# Altium schematic sheet STM32F103RCT6_Mini_System.SchDoc
size A1; SheetNumber: 1; SheetTotal: 1
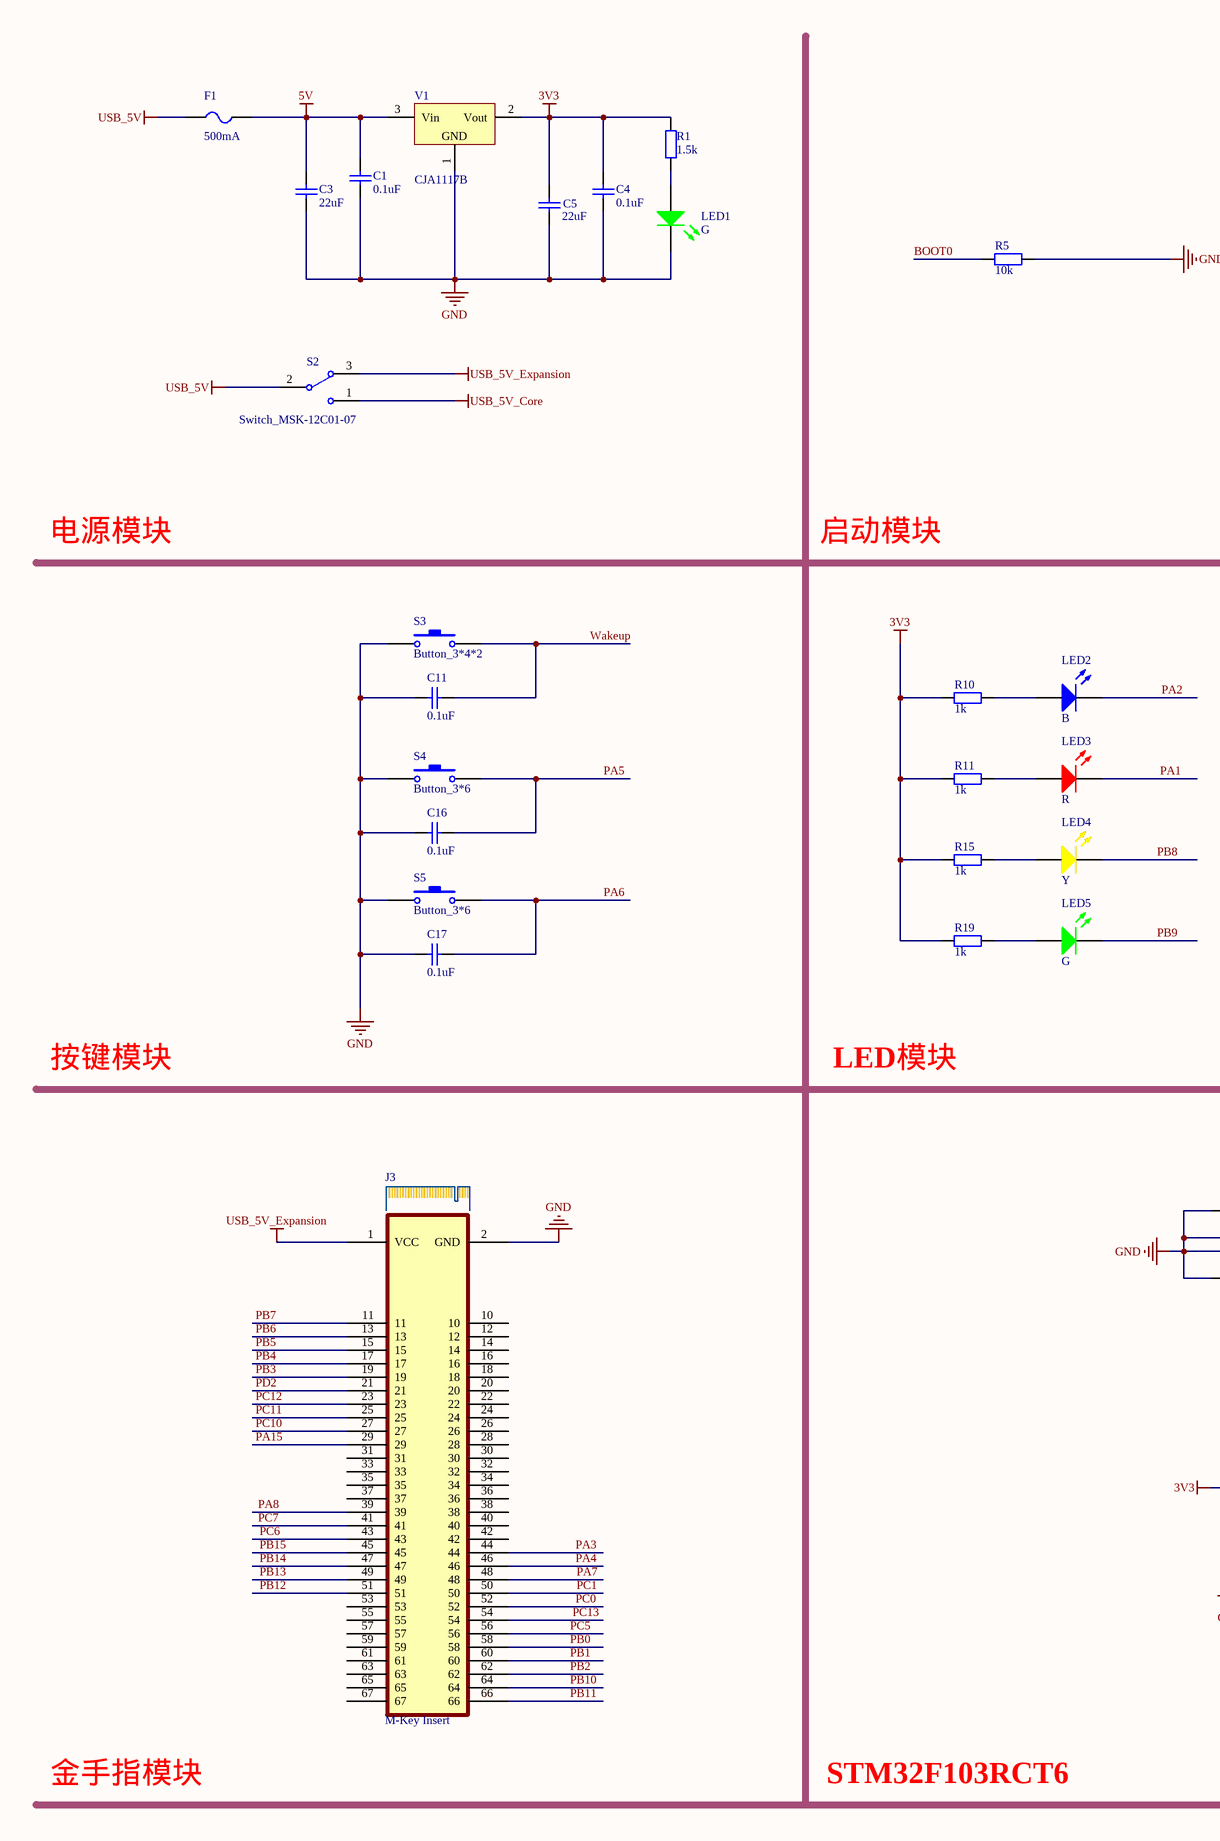
[diagram p0: STM32F103RCT6_Mini_System.SchDoc, left]
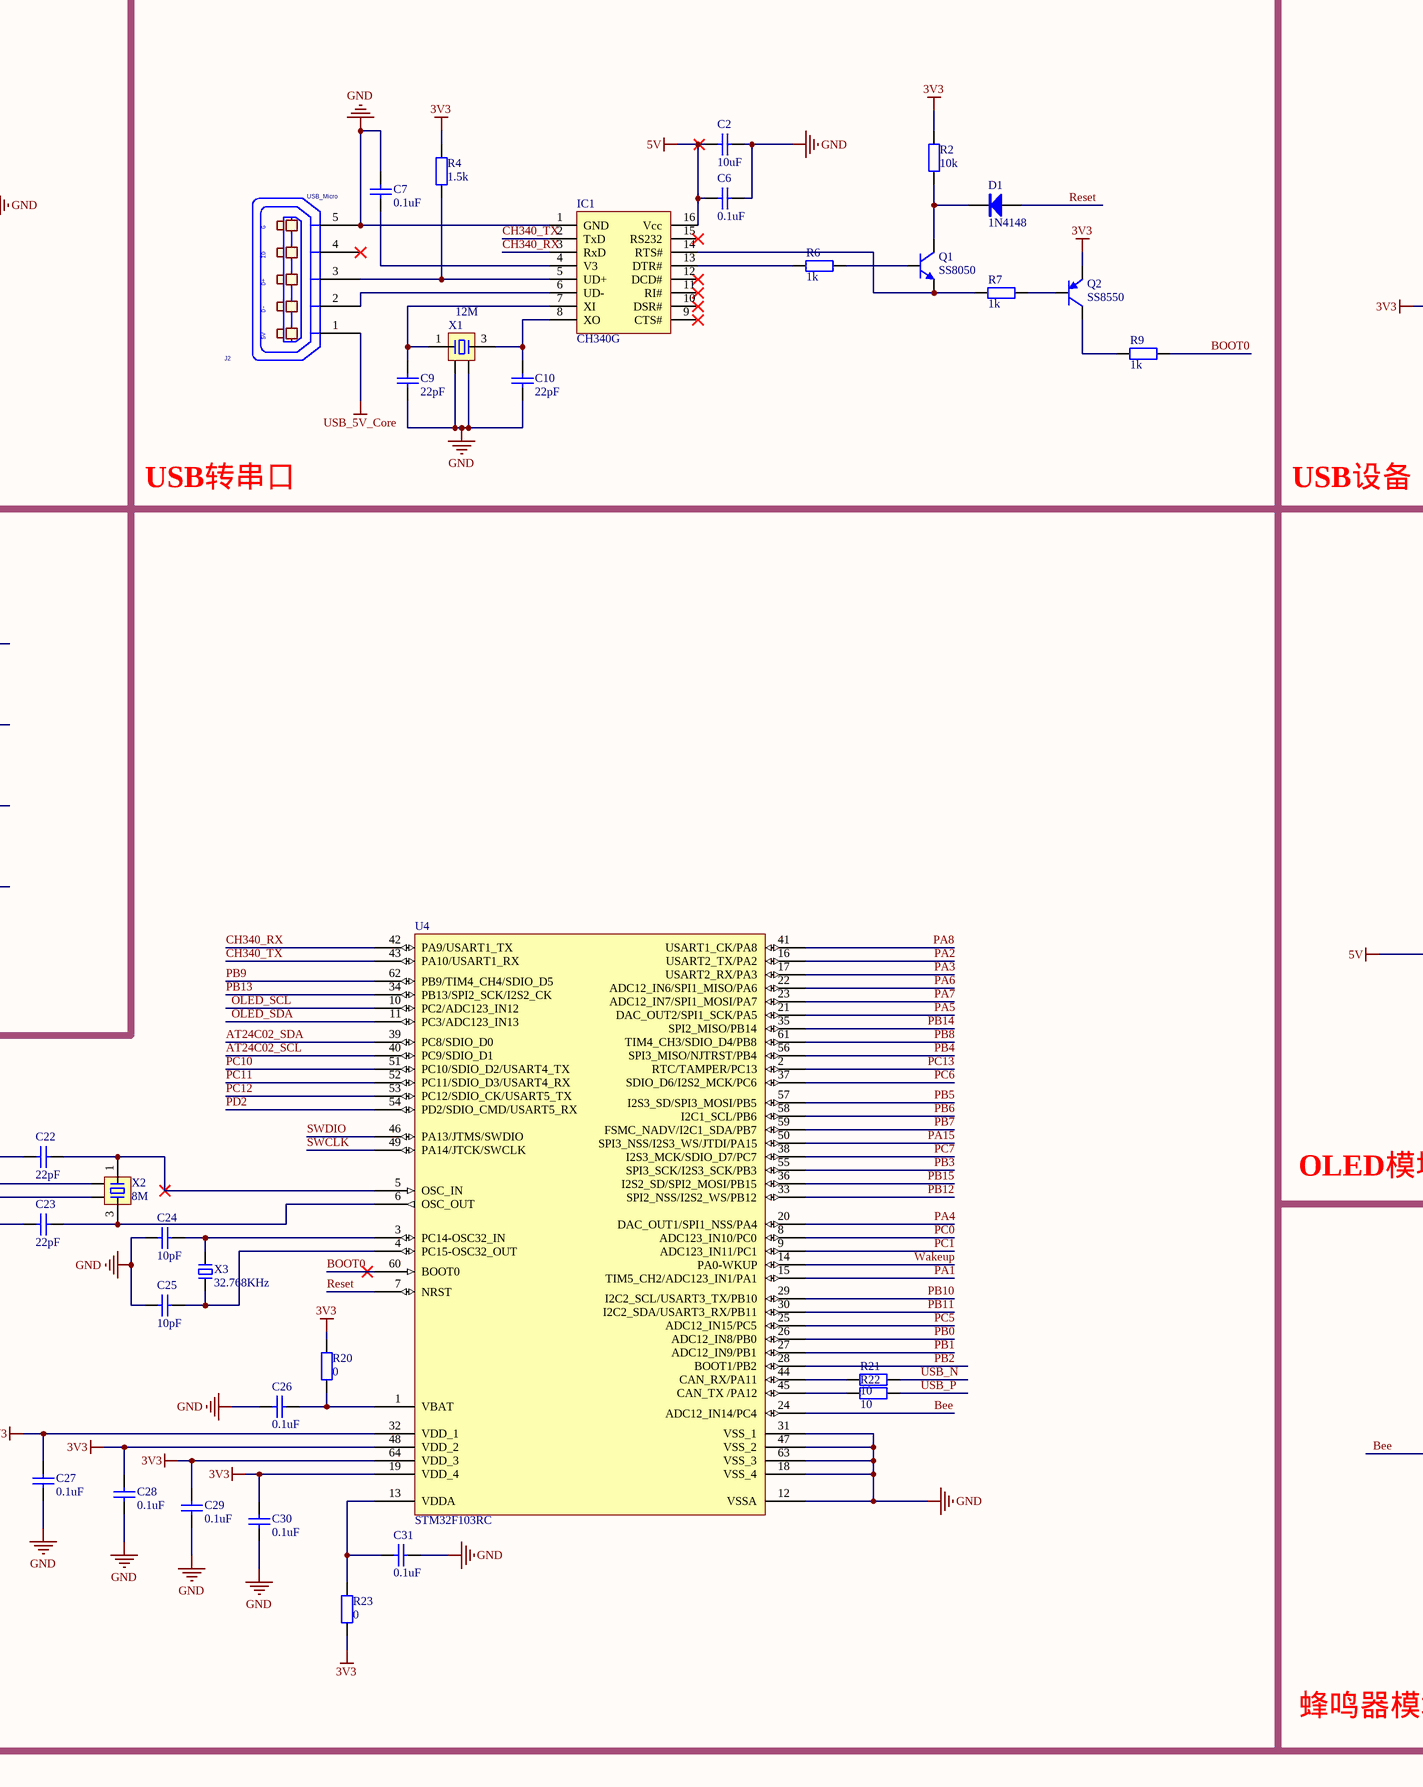
[diagram p1: STM32F103RCT6_Mini_System.SchDoc, middle]
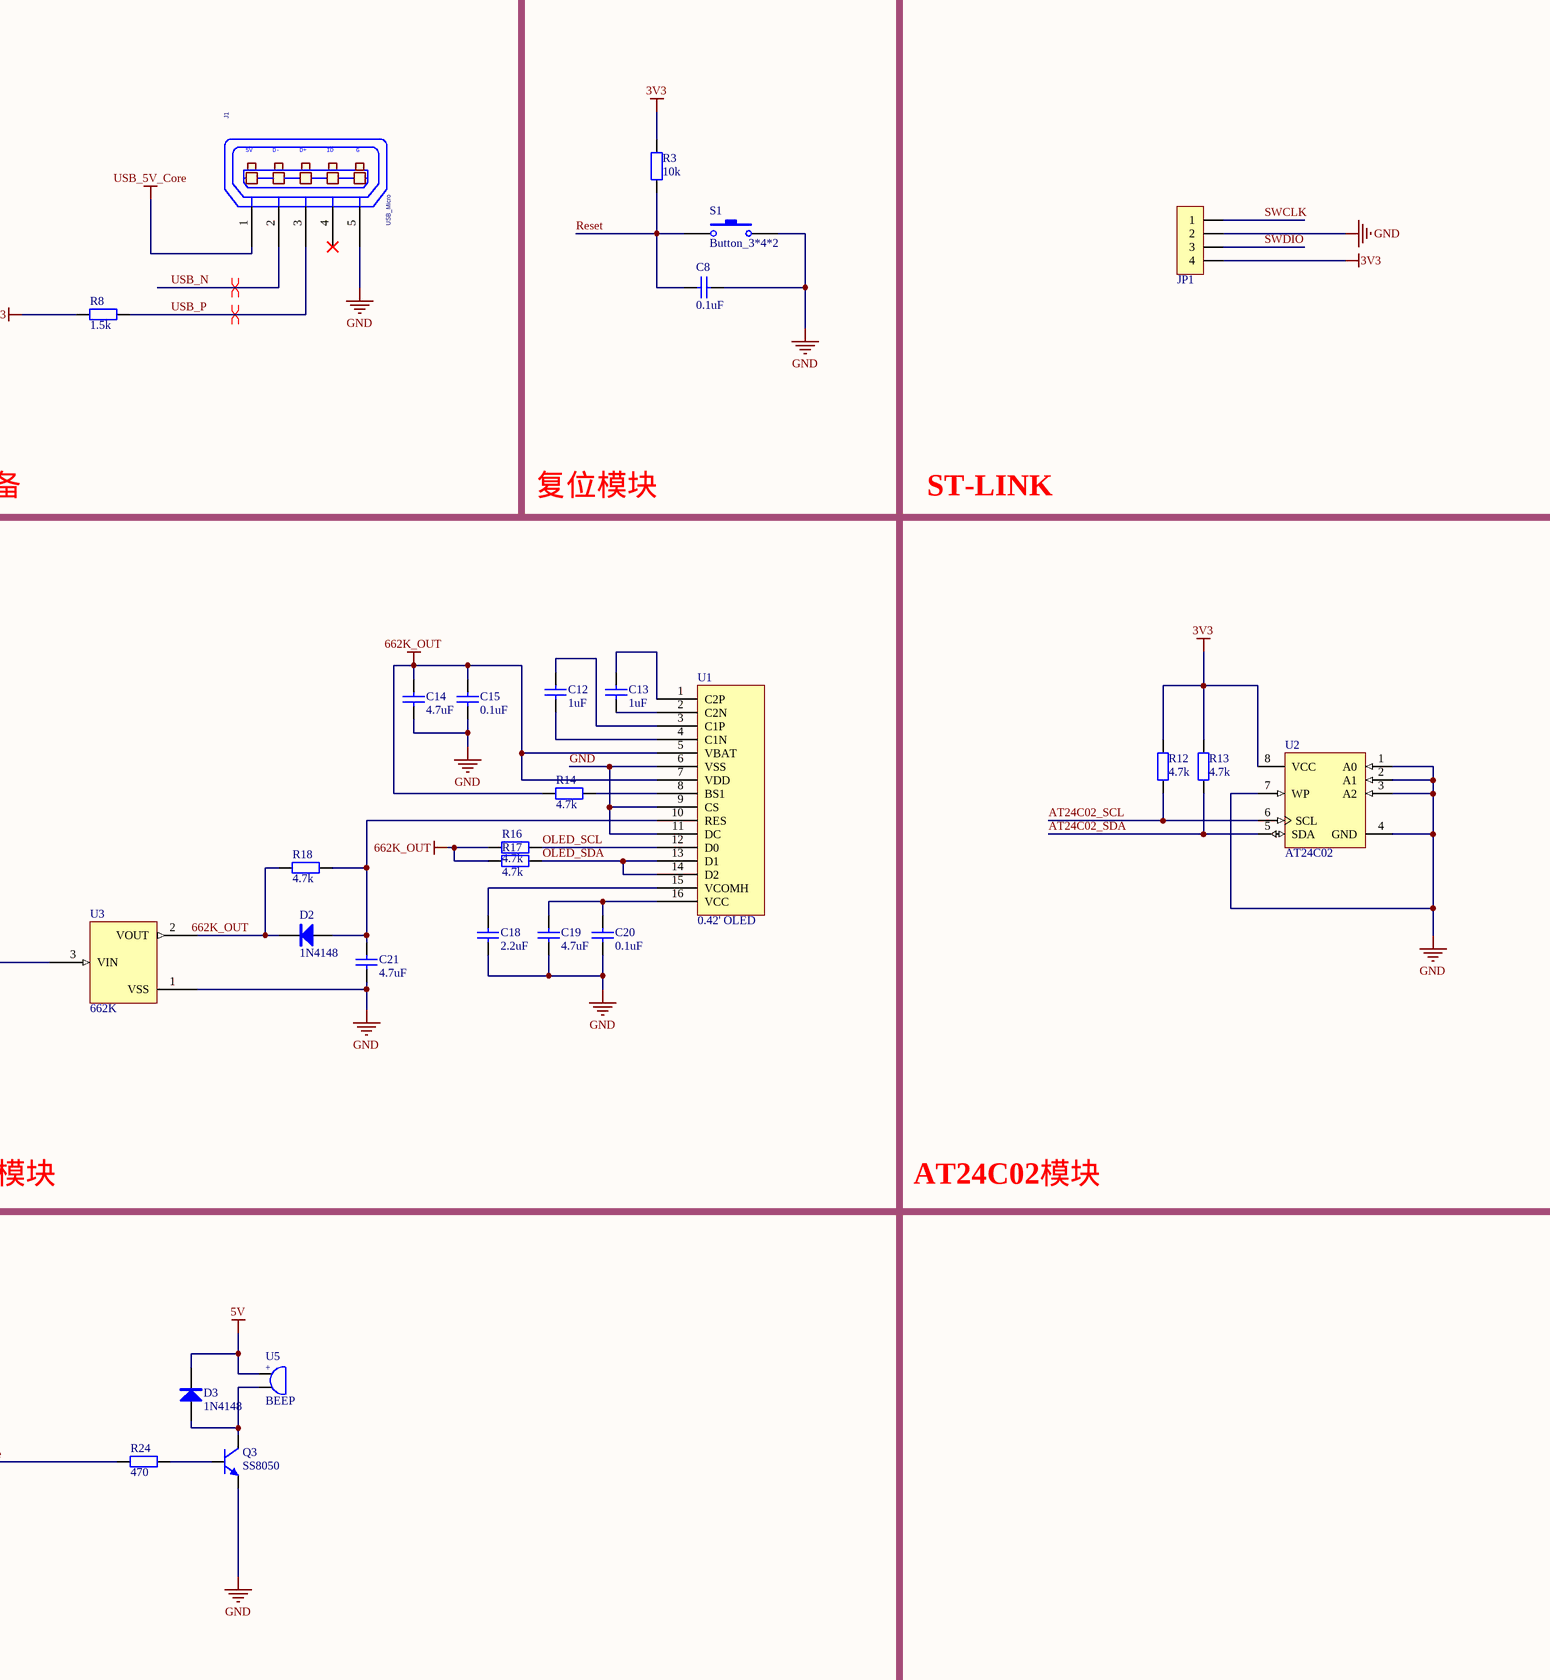
[diagram p2: STM32F103RCT6_Mini_System.SchDoc, right]

## Parts
C1  0.1uF  [0805_C]
C2  10uF  [0805_C]
C3  22uF  [0805_C]
C4  0.1uF  [0805_C]
C5  22uF  [0805_C]
C6  0.1uF  [0805_C]
C7  0.1uF  [0805_C]
C8  0.1uF  [0805_C]
C9  22pF  [0805_C]
C10  22pF  [0805_C]
C11  0.1uF  [0805_C]
C12  1uF  [0805_C]
C13  1uF  [0805_C]
C14  4.7uF  [0805_C]
C15  0.1uF  [0805_C]
C16  0.1uF  [0805_C]
C17  0.1uF  [0805_C]
C18  2.2uF  [0805_C]
C19  4.7uF  [0805_C]
C20  0.1uF  [0805_C]
C21  4.7uF  [0805_C]
C22  22pF  [0805_C]
C23  22pF  [0805_C]
C24  10pF  [0805_C]
C25  10pF  [0805_C]
C26  0.1uF  [0805_C]
C27  0.1uF  [0805_C]
C28  0.1uF  [0805_C]
C29  0.1uF  [0805_C]
C30  0.1uF  [0805_C]
C31  0.1uF  [0805_C]
D1  1N4148  [SOD-323]
D2  1N4148  [SOD-323]
D3  1N4148  [SOD-323]
F1  500mA  [FU 1210]
IC1  CH340G  [SOP16_N]
J1  USB_Micro  [USB-MICRO]
J2  USB_Micro  [USB-MICRO]
J3  M-Key Insert  [M-Key Insert big GND&VCC]
JP1  HDR-1X4  [XH2.54-WS-4P]  (value not drawn)
LED1  G  [LED 0805G]
LED2  B  [LED 0805B]
LED3  R  [LED 0805R]
LED4  Y  [LED 0805Y]
LED5  G  [LED 0805G]
Q1  SS8050  [SOT23-3N]
Q2  SS8550  [SOT23-3N]
Q3  SS8050  [SOT23-3N]
R1  1.5k  [0805_R]
R2  10k  [0805_R]
R3  10k  [0805_R]
R4  1.5k  [0805_R]
R5  10k  [0805_R]
R6  1k  [0805_R]
R7  1k  [0805_R]
R8  1.5k  [0805_R]
R9  1k  [0805_R]
R10  1k  [0805_R]
R11  1k  [0805_R]
R12  4.7k  [0805_R]
R13  4.7k  [0805_R]
R14  4.7k  [0805_R]
R15  1k  [0805_R]
R16  4.7k  [0805_R]
R17  4.7k  [0805_R]
R18  4.7k  [0805_R]
R19  1k  [0805_R]
R20  0  [0805_R]
R21  10  [0805_R]
R22  10  [0805_R]
R23  0  [0805_R]
R24  470  [0805_R]
S1  Button_3*4*2  [TSW SMD-3*4*2]
S2  Switch_MSK-12C01-07  [MSK-12C01-07]
S3  Button_3*4*2  [TSW SMD-3*4*2]
S4  Button_3*6  [TSW SMD-3*6*4.3_V]
S5  Button_3*6  [TSW SMD-3*6*4.3_V]
U1  0.42' OLED  [OLED 0.42']
U2  AT24C02  [SOP8_N]
U3  662K  [SOT23-3N]
U4  STM32F103RC  [LQFP64 10X10_N]
U5  BEEP  [Bee_5020]
V1  CJA1117B  [SOT89_N]
X1  12M  [OSC 3225-4P]
X2  8M  [OSC 3225-4P]
X3  32.768KHz  [OSC 3215-2P]

## Nets
3V3: C4.2 C5.2 C27.2 C28.2 C29.2 C30.2 JP1.4 Q2.2(E) R1.2 R2.2 R3.1 R4.1 R8.1 R10.1 R11.1 R12.2 R13.2 R15.1 R19.1 R20.1 R23.1 U2.8(VCC) U4.19(VDD_4) U4.32(VDD_1) U4.48(VDD_2) U4.64(VDD_3) V1.2(Vout)
5V: C1.2 C2.2 C3.2 C6.2 D3.2(K) F1.2 IC1.16(Vcc) U3.3(VIN) U5.1 V1.3(Vin)
662K_OUT: C14.2 C15.2 R14.1 R16.1 R17.1 U1.5(VBAT) U1.7(VDD)
GND: C1.1 C2.1 C3.1 C4.1 C5.1 C6.1 C7.2 C8.1 C9.1 C10.1 C11.1 C14.1 C15.1 C16.1 C17.1 C18.1 C19.1 C20.1 C21.1 C22.2 C23.2 C24.2 C25.2 C26.1 C27.1 C28.1 C29.1 C30.1 C31.1 IC1.1(GND) J1.5(P5) J2.5(P5) J3.2(GND) JP1.2 LED1.2(K) Q3.2(E) R5.2 S1.2 S3.1 S4.1 S5.1 U1.6(VSS) U1.9(CS) U1.11(DC) U2.1(A0) U2.2(A1) U2.3(A2) U2.4(GND) U2.7(WP) U3.1(VSS) U4.12(VSSA) U4.18(VSS_4) U4.31(VSS_1) U4.47(VSS_2) U4.63(VSS_3) V1.1(GND) X1.2 X1.4 X2.2 X2.4
USB_5V: F1.1 S2.2
USB_5V_Core: J1.1(P1) J2.1(P1) S2.1
USB_5V_Expansion: J3.1(VCC) S2.3
AT24C02_SCL: R12.1 U2.6(SCL) U4.40(PC9/SDIO_D1)
AT24C02_SDA: R13.1 U2.5(SDA) U4.39(PC8/SDIO_D0)
Bee: R24.1 U4.24(ADC12_IN14/PC4)
BOOT0: R5.1 R9.1 U4.60(BOOT0)
CH340_RX: IC1.3(RxD) U4.42(PA9/USART1_TX)
CH340_TX: IC1.2(TxD) U4.43(PA10/USART1_RX)
OLED_SCL: R16.2 U1.12(D0) U4.10(PC2/ADC123_IN12)
OLED_SDA: R17.2 U1.13(D1) U1.14(D2) U4.11(PC3/ADC123_IN13)
PA1: LED3.2(K) U4.15(TIM5_CH2/ADC123_IN1/PA1)
PA2: LED2.2(K) U4.16(USART2_TX/PA2)
PA3: J3.44 U4.17(USART2_RX/PA3)
PA4: J3.46 U4.20(DAC_OUT1/SPI1_NSS/PA4)
PA5: C16.2 S4.2 U4.21(DAC_OUT2/SPI1_SCK/PA5)
PA6: C17.2 S5.2 U4.22(ADC12_IN6/SPI1_MISO/PA6)
PA7: J3.48 U4.23(ADC12_IN7/SPI1_MOSI/PA7)
PA8: J3.39 U4.41(USART1_CK/PA8)
PA15: J3.29 U4.50(SPI3_NSS/I2S3_WS/JTDI/PA15)
PB0: J3.58 U4.26(ADC12_IN8/PB0)
PB1: J3.60 U4.27(ADC12_IN9/PB1)
PB2: J3.62 U4.28(BOOT1/PB2)
PB3: J3.19 U4.55(SPI3_SCK/I2S3_SCK/PB3)
PB4: J3.17 U4.56(SPI3_MISO/NJTRST/PB4)
PB5: J3.15 U4.57(I2S3_SD/SPI3_MOSI/PB5)
PB6: J3.13 U4.58(I2C1_SCL/PB6)
PB7: J3.11 U4.59(FSMC_NADV/I2C1_SDA/PB7)
PB8: LED4.2(K) U4.61(TIM4_CH3/SDIO_D4/PB8)
PB9: LED5.2(K) U4.62(PB9/TIM4_CH4/SDIO_D5)
PB10: J3.64 U4.29(I2C2_SCL/USART3_TX/PB10)
PB11: J3.66 U4.30(I2C2_SDA/USART3_RX/PB11)
PB12: J3.51 U4.33(SPI2_NSS/I2S2_WS/PB12)
PB13: J3.49 U4.34(PB13/SPI2_SCK/I2S2_CK)
PB14: J3.47 U4.35(SPI2_MISO/PB14)
PB15: J3.45 U4.36(I2S2_SD/SPI2_MOSI/PB15)
PC0: J3.52 U4.8(ADC123_IN10/PC0)
PC1: J3.50 U4.9(ADC123_IN11/PC1)
PC5: J3.56 U4.25(ADC12_IN15/PC5)
PC6: J3.43 U4.37(SDIO_D6/I2S2_MCK/PC6)
PC7: J3.41 U4.38(I2S3_MCK/SDIO_D7/PC7)
PC10: J3.27 U4.51(PC10/SDIO_D2/USART4_TX)
PC11: J3.25 U4.52(PC11/SDIO_D3/USART4_RX)
PC12: J3.23 U4.53(PC12/SDIO_CK/USART5_TX)
PC13: J3.54 U4.2(RTC/TAMPER/PC13)
PD2: J3.21 U4.54(PD2/SDIO_CMD/USART5_RX)
Reset: C8.2 D1.1(A) R3.2 S1.1 U4.7(NRST)
SWCLK: JP1.1 U4.49(PA14/JTCK/SWCLK)
SWDIO: JP1.3 U4.46(PA13/JTMS/SWDIO)
USB_N: J1.2(P2) R21.1
USB_P: J1.3(P3) R8.2 R22.1
Wakeup: C11.2 S3.2 U4.14(PA0-WKUP)
NetC7_1: C7.1 IC1.4(V3)
NetC9_2: C9.2 IC1.7(XI) X1.1
NetC10_2: C10.2 IC1.8(XO) X1.3
NetC12_1: C12.1 U1.3(C1P)
NetC12_2: C12.2 U1.4(C1N)
NetC13_1: C13.1 U1.1(C2P)
NetC13_2: C13.2 U1.2(C2N)
NetC18_2: C18.2 U1.15(VCOMH)
NetC19_2: C19.2 C20.2 U1.16(VCC)
NetC21_2: C21.2 D2.1(A) R18.2 U1.10(RES)
NetC22_1: C22.1 U4.5(OSC_IN) X2.1
NetC23_1: C23.1 U4.6(OSC_OUT) X2.3
NetC24_1: C24.1 U4.3(PC14-OSC32_IN) X3.2
NetC25_1: C25.1 U4.4(PC15-OSC32_OUT) X3.1
NetC26_2: C26.2 R20.2 U4.1(VBAT)
NetC31_2: C31.2 R23.2 U4.13(VDDA)
NetD1_2: D1.2(K) Q1.3(C) R2.1
NetD2_2: D2.2(K) R18.1 U3.2(VOUT)
NetD3_1: D3.1(A) Q3.3(C) U5.2
NetIC1_5: IC1.5(UD+) J2.3(P3) R4.2
NetIC1_6: IC1.6(UD-) J2.2(P2)
NetIC1_13: IC1.13(DTR#) R6.1
NetIC1_14: IC1.14(RTS#) Q1.2(E) R7.1
NetLED1_1: LED1.1(A) R1.1
NetLED2_1: LED2.1(A) R10.2
NetLED3_1: LED3.1(A) R11.2
NetLED4_1: LED4.1(A) R15.2
NetLED5_1: LED5.1(A) R19.2
NetQ1_1: Q1.1(B) R6.2
NetQ2_1: Q2.1(B) R7.2
NetQ2_3: Q2.3(C) R9.2
NetQ3_1: Q3.1(B) R24.2
NetR14_2: R14.2 U1.8(BS1)
NetR21_2: R21.2 U4.44(CAN_RX/PA11)
NetR22_2: R22.2 U4.45(CAN_TX_/PA12)

Not connected (* = marked no-connect by the designer): IC1 9(CTS#)* 10(DSR#)* 11(RI#)* 12(DCD#)* 15(RS232)*; J1 4(P4)*; J2 4(P4)*; J3 10 12 14 16 18 20 22 24 26 28 30 31 32 33 34 35 36 37 38 40 42 53 55 57 59 61 63 65 67

## Layout directives
differential pair: USB_N, USB_P

## Notes on the sheet
- 电源模块
- 启动模块
- USB转串口
- USB设备
- 复位模块
- ST-LINK
- 按键模块
- LED模块
- OLED模块
- AT24C02模块
- 金手指模块
- STM32F103RCT6
- 蜂鸣器模块
- Labels drawn without touching a wire or pin: 662K_OUT
- (in symbol BEEP) +
- (in symbol USB_Micro) G; ID; D+; D-; 5V

## Library data of the parts
C1-C8 C11 C16 C17 C26-C31 = Cap_SMD: 0805贴片电容; Value: 100nF; Voltage: 63V; Published: 8-Jun-2000; Revision: July-2002: Re-released for DXP Platform.; Publisher: Altium Limited; 实物样品照片: https://item.taobao.com/item.htm?spm=a230r.1.14.32.21fd24b7VWml4d&id=37914290992&ns=1&abbucket=13#detail
C9 C10 C12-C15 C18-C25 = Cap_SMD: 贴片电容; Value: 100nF; Voltage: 63V; Published: 8-Jun-2000; Revision: July-2002: Re-released for DXP Platform.; Publisher: Altium Limited; 实物样品照片: https://item.taobao.com/item.htm?spm=a230r.1.14.32.21fd24b7VWml4d&id=37914290992&ns=1&abbucket=13#detail
D1-D3 = 1N4148: 高速开关二极管; 版权归属: 源创客; BOM名称: 高速开关二极管; 学习资源: www.ooocke.com
F1 = FU: 贴片保险丝; 版权归属: 源创客; BOM名称: 贴片保险丝; 学习资源: www.ooocke.com
IC1 = CH340G: 串口转USB; 版权归属: 源创客; BOM名称: 串口转USB; 学习资源: www.ooocke.com
J1 J2 = USB_Micro: CLASS: IO; AGILE_PN: 211-80104; MFG_NAME01: ANYTRONIC CORPORATION LIMITED; MFG_PN01: 23970101#LCP-58LF; Temp_Range: -55&#8451; to 105&#8451;; CAD_APPROVED: Yes; ROHS: Yes; HEIGHT: 2.8MM
J3 = M-Key Insert  big GND&VCC: M.2 金手指
JP1 = Header 4: 4P接插件; 版权归属: 源创客; BOM名称: 4P接插件; 学习资源: www.ooocke.com
LED1 LED5 = LED_G: 绿色LED; Published: 8-Jun-2000; Revision: July-2002: Re-released for DXP Platform.; Publisher: Altium Limited
LED2 = LED_B: 蓝色LED; Published: 8-Jun-2000; Revision: July-2002: Re-released for DXP Platform.; Publisher: Altium Limited
LED3 = LED_R: 红色LED; Published: 8-Jun-2000; Revision: July-2002: Re-released for DXP Platform.; Publisher: Altium Limited
LED4 = LED_Y: 黄色LED; Published: 8-Jun-2000; Revision: July-2002: Re-released for DXP Platform.; Publisher: Altium Limited
Q1 Q3 = 8050-SMD: 高频放大-NPN型; 版权归属: 源创客; 属性: 40V 1.5A 1W 100MHZ; BOM名称: 高频放大-NPN型; 学习资源: www.ooocke.com
Q2 = 8550-SMD: 高频放大-PNP型; 版权归属: 源创客; 属性: 40V 1.5A 1W 100MHZ; BOM名称: 高频放大-PNP型; 学习资源: www.ooocke.com
R1-R5 R8 R12-R14 R16-R18 R20-R24 = Res_SMD: 0805贴片电阻; Value: 1K; Published: 8-Jun-2000; LatestRevisionDate: 17-Jul-2002; LatestRevisionNote: Re-released for DXP Platform.; PackageReference: AXIAL-0.4; Publisher: Altium Limited; PackageDescription: Axial Device, Thru-Hole; 2 Leads; 0.4 in Pin Spacing
R6 R7 R9-R11 R15 R19 = Res_SMD: 0805贴片电阻; Published: 8-Jun-2000; LatestRevisionDate: 17-Jul-2002; LatestRevisionNote: Re-released for DXP Platform.; PackageReference: AXIAL-0.4; Publisher: Altium Limited; PackageDescription: Axial Device, Thru-Hole; 2 Leads; 0.4 in Pin Spacing; Value: 1K
S4 S5 = Button_3*6: 3mm*4mm*按钮长度待定; Published: 24-Mar-1999; LatestRevisionDate: 17-Jul-2002; LatestRevisionNote: Re-released for DXP Platform.; PackageReference: SPST-2; Publisher: Altium Limited
U1 = 0.42' OLED: 0.42寸OLED显示屏 / 驱动芯片SSD1306
U2 = AT24C02: 256KB，I2C通信; Published: 20-Sep-2010; DatasheetVersion: 8517C,  Jan-2009; PackageVersion: revC, Mar-2005; PackageReference: 8S1; Publisher: Altium Limited; PackageDescription: 8-Lead (0.150" Wide Body), Plastic Gull Wing Small Outline (JEDEC SOIC); Code_JEDEC: MS-012-AA; Code_IPC: SOIC127P600-8; ComponentLink1Description: Manufacturer Link; ComponentLink1URL: http://www.atmel.com/products/serial/default.asp; ComponentLink2Description: Datasheet; ComponentLink2URL: http://www.atmel.com/dyn/resources/prod_documents/doc8517.pdf; ComponentLink3Description: Atmel.com Home; ComponentLink3URL: http://www.atmel.com
U3 = 662K: 线性LDO三极管稳压器芯片XC6206P332MR / 印字662K 封装SOT23
U4 = STM32F103RC: 32位STM单片机; BOM名称: 32位STM单片机
U5 = BEEP: 蜂鸣器5020; BOM名称: 蜂鸣器; 版权归属: 源创客; 学习资源: www.ooocke.com
V1 = CJA1117B: 三端稳压芯片; BOM名称: 稳压芯片; 版权归属: 源创客; 学习资源: www.ooocke.com
X1 X2 = XTAL-4P: 4脚无源晶振; 版权归属: 源创客; 负载电容: CL20pF; BOM名称: 4脚无源晶振; 学习资源: www.ooocke.com
X3 = XTAL-2P: 2脚无源脚晶振; 版权归属: 源创客; 负载电容: 10pF; BOM名称: 2脚无源脚晶振; 学习资源: www.ooocke.com
S1 S3 = Button_3*4*2: Published: 24-Mar-1999; LatestRevisionDate: 17-Jul-2002; LatestRevisionNote: Re-released for DXP Platform.; PackageReference: SPST-2; Publisher: Altium Limited